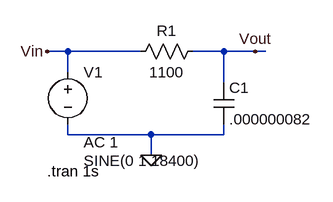
[diagram p0: schematic LoPass.asc]
LoPass.asc, the LTspice schematic file:
Version 4
SHEET 1 880 680
WIRE -48 80 -80 80
WIRE 64 80 -48 80
WIRE 192 80 144 80
WIRE 240 80 192 80
WIRE 256 80 240 80
WIRE -48 112 -48 80
WIRE 192 128 192 80
WIRE -48 208 -48 192
WIRE 80 208 -48 208
WIRE 192 208 192 192
WIRE 192 208 80 208
WIRE 80 240 80 208
FLAG 80 240 0
FLAG 240 80 Vout
FLAG -80 80 Vin
SYMBOL voltage -48 96 R0
WINDOW 123 24 124 Left 2
WINDOW 39 0 0 Left 0
WINDOW 3 24 152 Left 2
SYMATTR Value2 AC 1
SYMATTR InstName V1
SYMATTR Value SINE(0 1 18400)
SYMBOL res 160 64 R90
WINDOW 0 0 56 VBottom 2
WINDOW 3 32 56 VTop 2
SYMATTR InstName R1
SYMATTR Value 1100
SYMBOL cap 176 128 R0
SYMATTR InstName C1
SYMATTR Value .000000082
TEXT -80 264 Left 2 !.tran 1s

The netlist it stands for:
* LoPass.asc
V1 Vin 0 SINE(0 1 18400) AC 1
R1 Vout Vin 1100
C1 Vout 0 .000000082
.tran 1s
.backanno
.end